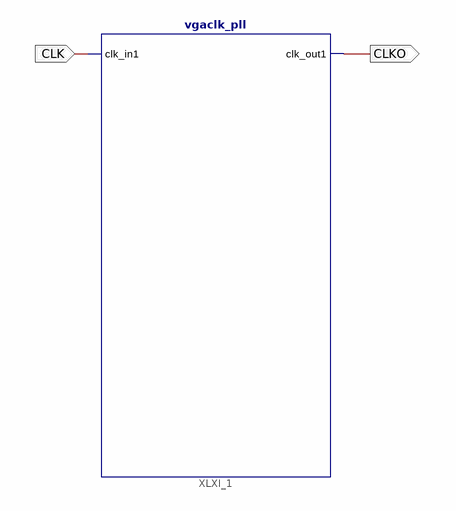
[diagram p0: schematic sheet 1]
// Xilinx ISE schematic vgaclk_pll_wrapper.sch (spartan6) as structural Verilog: 1 symbols, 2 ports
module vgaclk_pll_wrapper (
  input  CLK,
  output CLKO
);

  vgaclk_pll XLXI_1 (.clk_in1(CLK), .clk_out1(CLKO));
endmodule
